# EAGLE design amc7135-by-16-19mm-led-aux-driver-mk-1.0.1 (EAGLE 6.6.0)
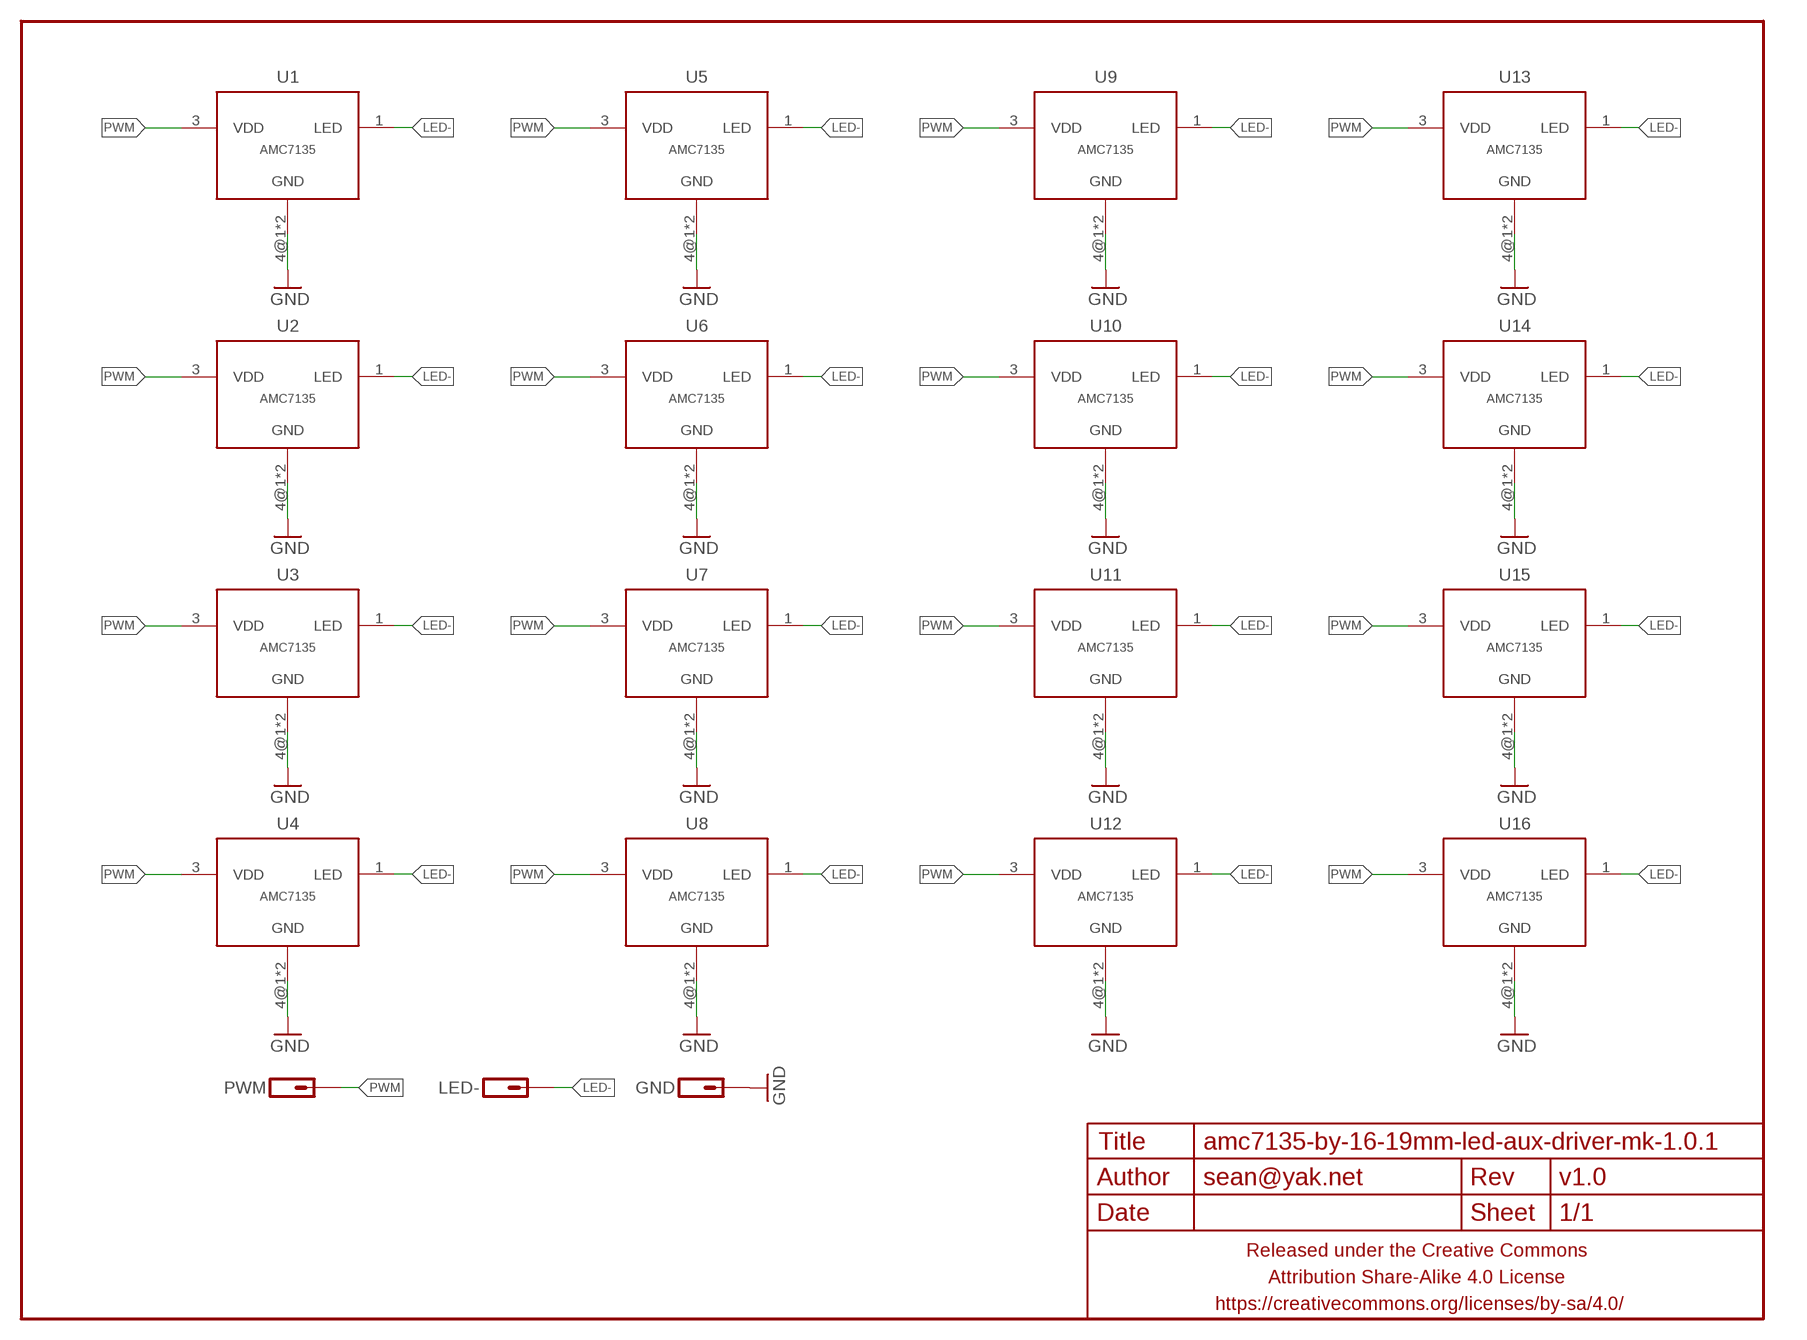
[diagram p0: schematic, sheet 1]

## Parts
FRAME1  FRAME-LETTERNO_PACKAGE  [DUMMY]
GND  M01PTH-1.2MM-NS  [1X01-1.2MM-NS]
LED-  M01PTH-1.2MM-NS  [1X01-1.2MM-NS]
PWM  M01PTH-0.9MM-CIR  [1X01-0.9MM-CIR]
U1  AMC7135  AMC7135ROUNDEDSMALER  [SOT89-ROUNDED-SMALLER]
U2  AMC7135  AMC7135ROUNDEDSMALER  [SOT89-ROUNDED-SMALLER]
U3  AMC7135  AMC7135ROUNDEDSMALER  [SOT89-ROUNDED-SMALLER]
U4  AMC7135  AMC7135ROUNDEDSMALER  [SOT89-ROUNDED-SMALLER]
U5  AMC7135  AMC7135ROUNDEDSMALER  [SOT89-ROUNDED-SMALLER]
U6  AMC7135  AMC7135ROUNDEDSMALER  [SOT89-ROUNDED-SMALLER]
U7  AMC7135  AMC7135ROUNDEDSMALER  [SOT89-ROUNDED-SMALLER]
U8  AMC7135  AMC7135ROUNDEDSMALER  [SOT89-ROUNDED-SMALLER]
U9  AMC7135  AMC7135ROUNDEDSMALER  [SOT89-ROUNDED-SMALLER]
U10  AMC7135  AMC7135ROUNDEDSMALER  [SOT89-ROUNDED-SMALLER]
U11  AMC7135  AMC7135ROUNDEDSMALER  [SOT89-ROUNDED-SMALLER]
U12  AMC7135  AMC7135ROUNDEDSMALER  [SOT89-ROUNDED-SMALLER]
U13  AMC7135  AMC7135ROUNDEDSMALER  [SOT89-ROUNDED-SMALLER]
U14  AMC7135  AMC7135ROUNDEDSMALER  [SOT89-ROUNDED-SMALLER]
U15  AMC7135  AMC7135ROUNDEDSMALER  [SOT89-ROUNDED-SMALLER]
U16  AMC7135  AMC7135ROUNDEDSMALER  [SOT89-ROUNDED-SMALLER]

## Nets
GND: GND.P$1 U1.4@1(GND) U1.4@2(GND) U2.4@1(GND) U2.4@2(GND) U3.4@1(GND) U3.4@2(GND) U4.4@1(GND) U4.4@2(GND) U5.4@1(GND) U5.4@2(GND) U6.4@1(GND) U6.4@2(GND) U7.4@1(GND) U7.4@2(GND) U8.4@1(GND) U8.4@2(GND) U9.4@1(GND) U9.4@2(GND) U10.4@1(GND) U10.4@2(GND) U11.4@1(GND) U11.4@2(GND) U12.4@1(GND) U12.4@2(GND) U13.4@1(GND) U13.4@2(GND) U14.4@1(GND) U14.4@2(GND) U15.4@1(GND) U15.4@2(GND) U16.4@1(GND) U16.4@2(GND)
LED-: LED-.P$1 U1.1(LED) U2.1(LED) U3.1(LED) U4.1(LED) U5.1(LED) U6.1(LED) U7.1(LED) U8.1(LED) U9.1(LED) U10.1(LED) U11.1(LED) U12.1(LED) U13.1(LED) U14.1(LED) U15.1(LED) U16.1(LED)
PWM: PWM.P$1 U1.3(VDD) U2.3(VDD) U3.3(VDD) U4.3(VDD) U5.3(VDD) U6.3(VDD) U7.3(VDD) U8.3(VDD) U9.3(VDD) U10.3(VDD) U11.3(VDD) U12.3(VDD) U13.3(VDD) U14.3(VDD) U15.3(VDD) U16.3(VDD)

## Library data of the parts
FRAME1 = a_parts:FRAME-LETTER: Schematic Frame Standard 8.5x11 US Letter frame; DESIGNER: sean@yak.net; VERSION: v1.0
GND LED- PWM = a_parts:M01: Header 1 Standard 1-pin 0.1" header. Use with straight break away headers (SKU : PRT-00116), right angle break away headers (PRT-00553), swiss pins (PRT-00743), machine pins (PRT-00117), and female headers (PRT-00115).
U1-U16 = a_parts:AMC7135

## Board
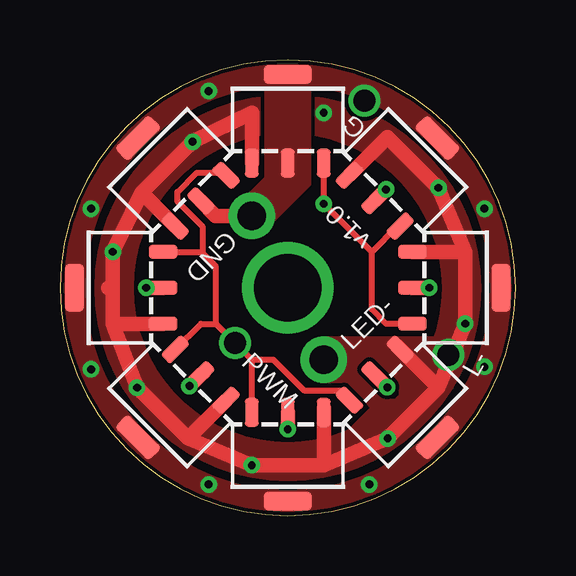
[diagram p1: board, top side]
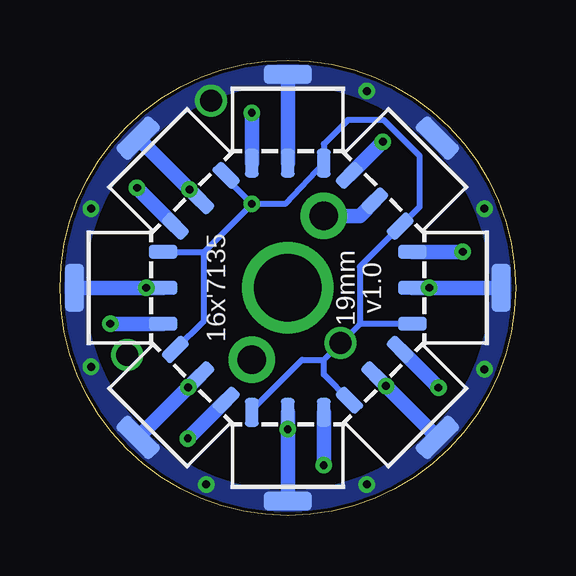
[diagram p2: board, bottom side, seen from below]

Size 19 x 19 mm. Coordinates in mm from the lower left corner, seen from the top.
Outline: 0,9.5 arc180 19,9.5 arc180 0,9.5
Copper layers (1*16): Top 0.0356mm / dielectric 1.5011mm / Bottom 0.0356mm
Design rules "LaenPCBOrder2 *": minimum track width 6mil, minimum drill 13mil, track to track 6mil, track to pad 6mil, pad to pad 6mil, via to via 6mil, smd to smd 6mil, copper to edge 6mil, drill to drill 6mil, minimum pad ring 7mil, minimum via ring 7mil, stop-mask expansion 3mil, vias tented up to drill 20mil, thermal gap 10mil

### Footprints (pad centres in the part's own frame; a part is rotated, then mirrored left to right if it is on the bottom)
1X01-1.2MM-NS = drill 1.2 pad 1.93: P$1 0,0
1X01-0.9MM-CIR = drill 0.9: P$1 0,0
SOT89-ROUNDED-SMALLER = smd 0.58 x 1.2: 1 -1.5,-1.8; 3 1.5,-1.8; 4@1 0,-1.8 | smd 2 x 0.8: 4@2 0,1.9

### Placement (x,y rotation side)
FRAME1  0,0 0 top
GND  8,12.5 0 top
LED-  11,6.5 0 top
PWM  7.3,7.2 0 top
U1  9.5,16.5 0 top
U2  14.4,14.4 315 top
U3  16.5,9.5 270 top
U4  14.4,4.6 225 top
U5  9.5,2.5 180 top
U6  4.6,4.6 135 top
U7  2.5,9.5 90 top
U8  4.6,14.4 45 top
U9  9.5,16.5 0 bottom
U10  14.4,14.4 45 bottom
U11  16.5,9.5 90 bottom
U12  14.4,4.6 135 bottom
U13  9.5,2.5 180 bottom
U14  4.6,4.6 225 bottom
U15  2.5,9.5 270 bottom
U16  4.6,14.4 315 bottom

### Tracks (layer width: path | path; a pad name or v marks a point on that pad's centre or on a via)
GND  (via drill 0.33, 0.9)
  Top 0.6: 6,6 U14.4@1 v5.4,5.4 | U12.4@1 | v3.6,9.5 U15.4@1 | U11.4@1 v15.4,9.5 | U10.4@1 v13.6,13.6 | U13.4@1 v9.5,3.6 | U12.4@1 v13.65,5.35 | v13.65,5.35 | U16.4@1 6.5,12.5 GND.P$1
  Bottom 0.6: U15.4@2 v3.6,9.5 U15.4@1 | U12.4@2 | U12.4@1 | U14.4@1 | U11.4@1 v15.4,9.5 U11.4@2 | U10.4@1 | U10.4@1 v13.6,13.6 U10.4@2 | U13.4@1 v9.5,3.6 U13.4@2 | U14.4@1 | U14.4@1 v5.4,5.4 | v5.4,5.4 | v5.4,5.4 U14.4@2 | U12.4@1 v13.65,5.35 U12.4@2 | U9.4@1 U9.4@2 | U16.4@1 6.5,12.5 GND.P$1
  other vias: 1.3,12.8 6.2,17.7 17.7,12.8 17.7,6.2 12.9,1.3 6.2,1.3 1.3,6.1 12.7,17.3
  pour Bottom (rank 6, no thermals): 0,9.5 arc-90 9.5,19 arc-90 19,9.5 18,9.5 arc90 9.5,18 arc90 1,9.5
  pour Bottom (rank 6, no thermals): 19,9.5 arc-90 9.5,0 arc-90 0,9.5 1,9.5 arc90 9.5,1 arc90 18,9.5
  pour Top (rank 6, no thermals): 0,9.5 arc-90 9.5,19 arc-90 19,9.5 18,9.5 arc90 9.5,18 arc90 1,9.5
  pour Top (rank 6, no thermals): 19,9.5 arc-90 9.5,0 arc-90 0,9.5 1,9.5 arc90 9.5,1 arc90 18,9.5
  pour Top (rank 2, no thermals): 8.6,19 10.4,19 10.4,13.8 8.3,11.7 7.8,11.7 7,12.5 8.6,14.1
LED-  (via drill 0.33, 0.9)
  Top 0.6: 15.79,5.33 U4.1 14.02,7.1 | U7.1 2.2,8 | 11,2.1 U5.1 11,4.5 | 15.79,5.33 v13.67,3.21 11,2.1 | 5.33,3.21 v3.21,5.33 2.2,8 | U8.1 3.4,13.48 | U6.1 5.33,3.21 | 2.2,8 2.2,9.5 | 2.2,9.5 v2.2,11 3.4,13.48 | 11,2.1 v8,2.1 5.33,3.21 | U1.1 8,16.8 v5.53,15.59 | U2.1 13.66,15.78 v15.79,13.67 16.9,11 | 15.79,5.33 v16.9,8 16.9,11 | U3.1 16.9,11 | 2.2,9.5 2,9.5 | 5.5,15.58 3.4,13.48
  Bottom 0.6: U16.1 v5.53,15.59 | U15.1 v2.2,11 | U9.1 v11,16.8 | U12.1 v13.67,3.21 | U10.1 v15.79,13.67 | U14.1 v3.21,5.33 | U13.1 v8,2.1 | U11.1 v16.9,8
  other vias: 16.2,6.7
  pour Top (rank 2, no thermals): 10.3,6.2 10.9,5.6 12,5.6 13,4.5 12,3.5 13,3.5 13.9,4.4 14.3,4.4 14.3,4.8 13.5,4.8 12.4,5.9 12.4,6.3 12.7,6.6 13.1,6.6 14.2,5.5 14.2,5 15.5,5 16.5,6 16.5,7.4 10.9,7.4 10.3,6.8
  pour Top (isolate 0.152, rank 5, no thermals): 1.5,9.5 arc-90 9.5,17.5 arc-90 17.5,9.5 16,9.5 arc90 9.5,16 arc90 3,9.5
  pour Top (rank 5, no thermals): 17.5,9.5 arc-90 9.5,1.5 arc-90 1.5,9.5 3,9.5 arc90 9.5,3 arc90 16,9.5
N$2  (via drill 2.8 pad 3.81)
  other vias: 9.5,9.5
PWM  (via drill 0.33)
  Top 0.25: U8.3 6.72,14.3 5.7,14.3 4.9,13.5 4.9,13.1 5.94,12.06 5.94,10.94 | U5.3 8,6.5 | U1.3 v11,13 13,11 | U3.3 13.6,8 13,8.6 13,11 | U2.3 14.07,12.07 13,11 | U4.3 11.68,5.2 10.2,5.2 8.9,6.5 8,6.5 | 6.5,8 PWM.P$1 8,6.5 | U7.3 5.88,11 5.94,10.94 | 6.5,8 6.5,10.38 5.94,10.94 | U6.3 5.88,8 6.5,8
  Bottom 0.25: U14.3 8,5.88 8,6.5 | U13.3 11,4.4 8.9,6.5 8,6.5 | v11,13 9.6,13 U9.3 8,15.5 7,16.5 5.5,16.5 4,15 4,12.88 U16.3 6.5,10.38 6.5,8 | 13,11 v11,13 | U12.3 13,8.12 13,11 | U11.3 13,11 | U10.3 12.07,14.07 v11,13 | U15.3 6.5,8 | 6.5,8 PWM.P$1 8,6.5

### Text on the board
tPlace: G | GND | PWM | LED- | L-
bPlace: 19mm | 16x'7135